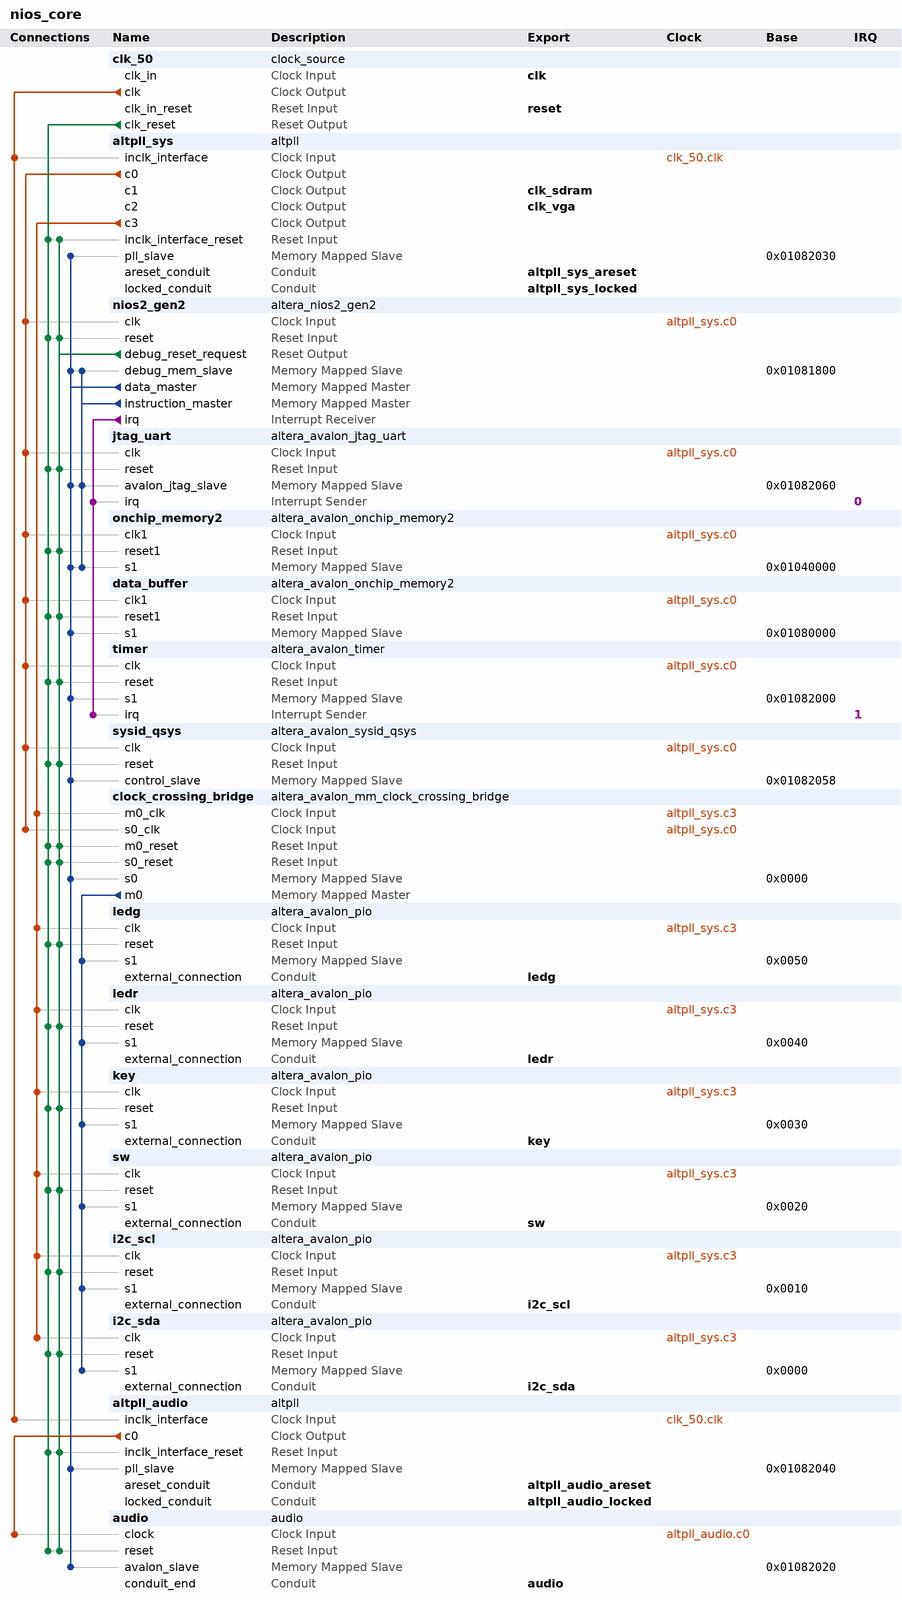
[diagram p0: system contents]
# Platform Designer (Qsys) system nios_core, Cyclone IV E EP4CE115F29C7
# Parameters at their usual value, and those the tool derives, are not listed.
package require -exact qsys 17.1
create_system nios_core
set_project_property DEVICE_FAMILY {Cyclone IV E}
set_project_property DEVICE EP4CE115F29C7

add_instance clk_50 clock_source 17.1
set_instance_parameter_value clk_50 clockFrequency 50000000

add_instance altpll_sys altpll 17.1
set_instance_parameter_value altpll_sys CLK0_DIVIDE_BY 1
set_instance_parameter_value altpll_sys CLK0_MULTIPLY_BY 2
set_instance_parameter_value altpll_sys CLK1_DIVIDE_BY 1
set_instance_parameter_value altpll_sys CLK1_DUTY_CYCLE 50
set_instance_parameter_value altpll_sys CLK1_MULTIPLY_BY 2
set_instance_parameter_value altpll_sys CLK1_PHASE_SHIFT 1806
set_instance_parameter_value altpll_sys CLK2_DIVIDE_BY 2
set_instance_parameter_value altpll_sys CLK2_DUTY_CYCLE 50
set_instance_parameter_value altpll_sys CLK2_MULTIPLY_BY 1
set_instance_parameter_value altpll_sys CLK2_PHASE_SHIFT 0
set_instance_parameter_value altpll_sys CLK3_DIVIDE_BY 5
set_instance_parameter_value altpll_sys CLK3_DUTY_CYCLE 50
set_instance_parameter_value altpll_sys CLK3_MULTIPLY_BY 1
set_instance_parameter_value altpll_sys CLK3_PHASE_SHIFT 0
set_instance_parameter_value altpll_sys INCLK0_INPUT_FREQUENCY 20000
set_instance_parameter_value altpll_sys PORT_ARESET PORT_USED
set_instance_parameter_value altpll_sys PORT_LOCKED PORT_USED
set_instance_parameter_value altpll_sys PORT_clk1 PORT_USED
set_instance_parameter_value altpll_sys PORT_clk2 PORT_USED
set_instance_parameter_value altpll_sys PORT_clk3 PORT_USED

add_instance nios2_gen2 altera_nios2_gen2 17.1
set_instance_parameter_value nios2_gen2 dcache_size 2048
set_instance_parameter_value nios2_gen2 dividerType srt2
set_instance_parameter_value nios2_gen2 exceptionSlave onchip_memory2.s1
set_instance_parameter_value nios2_gen2 icache_size 4096
set_instance_parameter_value nios2_gen2 impl Fast
set_instance_parameter_value nios2_gen2 resetSlave onchip_memory2.s1

add_instance jtag_uart altera_avalon_jtag_uart 17.1
set_instance_parameter_value jtag_uart simInteractiveOptions NO_INTERACTIVE_WINDOWS

add_instance onchip_memory2 altera_avalon_onchip_memory2 17.1
set_instance_parameter_value onchip_memory2 dataWidth 32
set_instance_parameter_value onchip_memory2 dualPort false
set_instance_parameter_value onchip_memory2 initMemContent true
set_instance_parameter_value onchip_memory2 initializationFileName onchip_mem.hex
set_instance_parameter_value onchip_memory2 memorySize 262144

add_instance data_buffer altera_avalon_onchip_memory2 17.1
set_instance_parameter_value data_buffer dataWidth 32
set_instance_parameter_value data_buffer dualPort false
set_instance_parameter_value data_buffer initMemContent true
set_instance_parameter_value data_buffer initializationFileName onchip_mem.hex
set_instance_parameter_value data_buffer memorySize 4096

add_instance timer altera_avalon_timer 17.1
set_instance_parameter_value timer period 1
set_instance_parameter_value timer periodUnits MSEC

add_instance sysid_qsys altera_avalon_sysid_qsys 17.1
set_instance_parameter_value sysid_qsys id 1702376594

add_instance clock_crossing_bridge altera_avalon_mm_clock_crossing_bridge 17.1
set_instance_parameter_value clock_crossing_bridge ADDRESS_WIDTH 9
set_instance_parameter_value clock_crossing_bridge COMMAND_FIFO_DEPTH 32
set_instance_parameter_value clock_crossing_bridge DATA_WIDTH 32
set_instance_parameter_value clock_crossing_bridge MASTER_SYNC_DEPTH 3
set_instance_parameter_value clock_crossing_bridge MAX_BURST_SIZE 1
set_instance_parameter_value clock_crossing_bridge RESPONSE_FIFO_DEPTH 64
set_instance_parameter_value clock_crossing_bridge SLAVE_SYNC_DEPTH 3
set_instance_parameter_value clock_crossing_bridge USE_AUTO_ADDRESS_WIDTH 0

add_instance ledg altera_avalon_pio 17.1
set_instance_parameter_value ledg direction Output
set_instance_parameter_value ledg width 8

add_instance ledr altera_avalon_pio 17.1
set_instance_parameter_value ledr direction Output
set_instance_parameter_value ledr width 16

add_instance key altera_avalon_pio 17.1
set_instance_parameter_value key direction Input
set_instance_parameter_value key width 4

add_instance sw altera_avalon_pio 17.1
set_instance_parameter_value sw direction Input
set_instance_parameter_value sw width 16

add_instance i2c_scl altera_avalon_pio 17.1
set_instance_parameter_value i2c_scl direction Output
set_instance_parameter_value i2c_scl width 1

add_instance i2c_sda altera_avalon_pio 17.1
set_instance_parameter_value i2c_sda direction Bidir
set_instance_parameter_value i2c_sda width 1

add_instance altpll_audio altpll 17.1
set_instance_parameter_value altpll_audio CLK0_DIVIDE_BY 3125
set_instance_parameter_value altpll_audio CLK0_MULTIPLY_BY 1152
set_instance_parameter_value altpll_audio INCLK0_INPUT_FREQUENCY 20000
set_instance_parameter_value altpll_audio PORT_ARESET PORT_USED
set_instance_parameter_value altpll_audio PORT_LOCKED PORT_USED
set_instance_parameter_value altpll_audio PORT_clk1 PORT_UNUSED
set_instance_parameter_value altpll_audio PORT_clk2 PORT_UNUSED
set_instance_parameter_value altpll_audio PORT_clk3 PORT_UNUSED

add_instance audio audio 1.0

# connections
add_connection altpll_audio.c0 audio.clock clock
add_connection altpll_sys.c0 clock_crossing_bridge.s0_clk clock
add_connection altpll_sys.c0 data_buffer.clk1 clock
add_connection altpll_sys.c0 jtag_uart.clk clock
add_connection altpll_sys.c0 nios2_gen2.clk clock
add_connection altpll_sys.c0 onchip_memory2.clk1 clock
add_connection altpll_sys.c0 sysid_qsys.clk clock
add_connection altpll_sys.c0 timer.clk clock
add_connection altpll_sys.c3 clock_crossing_bridge.m0_clk clock
add_connection altpll_sys.c3 i2c_scl.clk clock
add_connection altpll_sys.c3 i2c_sda.clk clock
add_connection altpll_sys.c3 key.clk clock
add_connection altpll_sys.c3 ledg.clk clock
add_connection altpll_sys.c3 ledr.clk clock
add_connection altpll_sys.c3 sw.clk clock
add_connection clk_50.clk altpll_audio.inclk_interface clock
add_connection clk_50.clk altpll_sys.inclk_interface clock
add_connection clk_50.clk_reset altpll_audio.inclk_interface_reset reset
add_connection clk_50.clk_reset altpll_sys.inclk_interface_reset reset
add_connection clk_50.clk_reset audio.reset reset
add_connection clk_50.clk_reset clock_crossing_bridge.m0_reset reset
add_connection clk_50.clk_reset clock_crossing_bridge.s0_reset reset
add_connection clk_50.clk_reset data_buffer.reset1 reset
add_connection clk_50.clk_reset i2c_scl.reset reset
add_connection clk_50.clk_reset i2c_sda.reset reset
add_connection clk_50.clk_reset jtag_uart.reset reset
add_connection clk_50.clk_reset key.reset reset
add_connection clk_50.clk_reset ledg.reset reset
add_connection clk_50.clk_reset ledr.reset reset
add_connection clk_50.clk_reset nios2_gen2.reset reset
add_connection clk_50.clk_reset onchip_memory2.reset1 reset
add_connection clk_50.clk_reset sw.reset reset
add_connection clk_50.clk_reset sysid_qsys.reset reset
add_connection clk_50.clk_reset timer.reset reset
add_connection nios2_gen2.debug_reset_request altpll_audio.inclk_interface_reset reset
add_connection nios2_gen2.debug_reset_request altpll_sys.inclk_interface_reset reset
add_connection nios2_gen2.debug_reset_request audio.reset reset
add_connection nios2_gen2.debug_reset_request clock_crossing_bridge.m0_reset reset
add_connection nios2_gen2.debug_reset_request clock_crossing_bridge.s0_reset reset
add_connection nios2_gen2.debug_reset_request data_buffer.reset1 reset
add_connection nios2_gen2.debug_reset_request i2c_scl.reset reset
add_connection nios2_gen2.debug_reset_request i2c_sda.reset reset
add_connection nios2_gen2.debug_reset_request jtag_uart.reset reset
add_connection nios2_gen2.debug_reset_request key.reset reset
add_connection nios2_gen2.debug_reset_request ledg.reset reset
add_connection nios2_gen2.debug_reset_request ledr.reset reset
add_connection nios2_gen2.debug_reset_request nios2_gen2.reset reset
add_connection nios2_gen2.debug_reset_request onchip_memory2.reset1 reset
add_connection nios2_gen2.debug_reset_request sw.reset reset
add_connection nios2_gen2.debug_reset_request sysid_qsys.reset reset
add_connection nios2_gen2.debug_reset_request timer.reset reset
add_connection clock_crossing_bridge.m0 i2c_scl.s1 avalon
set_connection_parameter_value clock_crossing_bridge.m0/i2c_scl.s1 baseAddress 0x0010
add_connection clock_crossing_bridge.m0 i2c_sda.s1 avalon
set_connection_parameter_value clock_crossing_bridge.m0/i2c_sda.s1 baseAddress 0x0000
add_connection clock_crossing_bridge.m0 key.s1 avalon
set_connection_parameter_value clock_crossing_bridge.m0/key.s1 baseAddress 0x0030
add_connection clock_crossing_bridge.m0 ledg.s1 avalon
set_connection_parameter_value clock_crossing_bridge.m0/ledg.s1 baseAddress 0x0050
add_connection clock_crossing_bridge.m0 ledr.s1 avalon
set_connection_parameter_value clock_crossing_bridge.m0/ledr.s1 baseAddress 0x0040
add_connection clock_crossing_bridge.m0 sw.s1 avalon
set_connection_parameter_value clock_crossing_bridge.m0/sw.s1 baseAddress 0x0020
add_connection nios2_gen2.data_master altpll_audio.pll_slave avalon
set_connection_parameter_value nios2_gen2.data_master/altpll_audio.pll_slave baseAddress 0x01082040
add_connection nios2_gen2.data_master altpll_sys.pll_slave avalon
set_connection_parameter_value nios2_gen2.data_master/altpll_sys.pll_slave baseAddress 0x01082030
add_connection nios2_gen2.data_master audio.avalon_slave avalon
set_connection_parameter_value nios2_gen2.data_master/audio.avalon_slave baseAddress 0x01082020
add_connection nios2_gen2.data_master clock_crossing_bridge.s0 avalon
set_connection_parameter_value nios2_gen2.data_master/clock_crossing_bridge.s0 baseAddress 0x0000
add_connection nios2_gen2.data_master data_buffer.s1 avalon
set_connection_parameter_value nios2_gen2.data_master/data_buffer.s1 baseAddress 0x01080000
add_connection nios2_gen2.data_master jtag_uart.avalon_jtag_slave avalon
set_connection_parameter_value nios2_gen2.data_master/jtag_uart.avalon_jtag_slave baseAddress 0x01082060
add_connection nios2_gen2.data_master nios2_gen2.debug_mem_slave avalon
set_connection_parameter_value nios2_gen2.data_master/nios2_gen2.debug_mem_slave baseAddress 0x01081800
add_connection nios2_gen2.data_master onchip_memory2.s1 avalon
set_connection_parameter_value nios2_gen2.data_master/onchip_memory2.s1 baseAddress 0x01040000
add_connection nios2_gen2.data_master sysid_qsys.control_slave avalon
set_connection_parameter_value nios2_gen2.data_master/sysid_qsys.control_slave baseAddress 0x01082058
add_connection nios2_gen2.data_master timer.s1 avalon
set_connection_parameter_value nios2_gen2.data_master/timer.s1 baseAddress 0x01082000
add_connection nios2_gen2.instruction_master jtag_uart.avalon_jtag_slave avalon
set_connection_parameter_value nios2_gen2.instruction_master/jtag_uart.avalon_jtag_slave baseAddress 0x01082060
add_connection nios2_gen2.instruction_master nios2_gen2.debug_mem_slave avalon
set_connection_parameter_value nios2_gen2.instruction_master/nios2_gen2.debug_mem_slave baseAddress 0x01081800
add_connection nios2_gen2.instruction_master onchip_memory2.s1 avalon
set_connection_parameter_value nios2_gen2.instruction_master/onchip_memory2.s1 baseAddress 0x01040000
add_connection nios2_gen2.irq jtag_uart.irq interrupt
set_connection_parameter_value nios2_gen2.irq/jtag_uart.irq irqNumber 0
add_connection nios2_gen2.irq timer.irq interrupt
set_connection_parameter_value nios2_gen2.irq/timer.irq irqNumber 1

# exported interfaces
add_interface altpll_audio_areset conduit end
set_interface_property altpll_audio_areset EXPORT_OF altpll_audio.areset_conduit
add_interface altpll_audio_locked conduit end
set_interface_property altpll_audio_locked EXPORT_OF altpll_audio.locked_conduit
add_interface altpll_sys_areset conduit end
set_interface_property altpll_sys_areset EXPORT_OF altpll_sys.areset_conduit
add_interface altpll_sys_locked conduit end
set_interface_property altpll_sys_locked EXPORT_OF altpll_sys.locked_conduit
add_interface audio conduit end
set_interface_property audio EXPORT_OF audio.conduit_end
add_interface clk clock sink
set_interface_property clk EXPORT_OF clk_50.clk_in
add_interface clk_sdram clock source
set_interface_property clk_sdram EXPORT_OF altpll_sys.c1
add_interface clk_vga clock source
set_interface_property clk_vga EXPORT_OF altpll_sys.c2
add_interface i2c_scl conduit end
set_interface_property i2c_scl EXPORT_OF i2c_scl.external_connection
add_interface i2c_sda conduit end
set_interface_property i2c_sda EXPORT_OF i2c_sda.external_connection
add_interface key conduit end
set_interface_property key EXPORT_OF key.external_connection
add_interface ledg conduit end
set_interface_property ledg EXPORT_OF ledg.external_connection
add_interface ledr conduit end
set_interface_property ledr EXPORT_OF ledr.external_connection
add_interface reset reset sink
set_interface_property reset EXPORT_OF clk_50.clk_in_reset
add_interface sw conduit end
set_interface_property sw EXPORT_OF sw.external_connection

set_interconnect_requirement {$system} qsys_mm.clockCrossingAdapter HANDSHAKE
set_interconnect_requirement {$system} qsys_mm.enableEccProtection FALSE
set_interconnect_requirement {$system} qsys_mm.insertDefaultSlave FALSE
set_interconnect_requirement {$system} qsys_mm.maxAdditionalLatency 0

save_system nios_core.qsys
